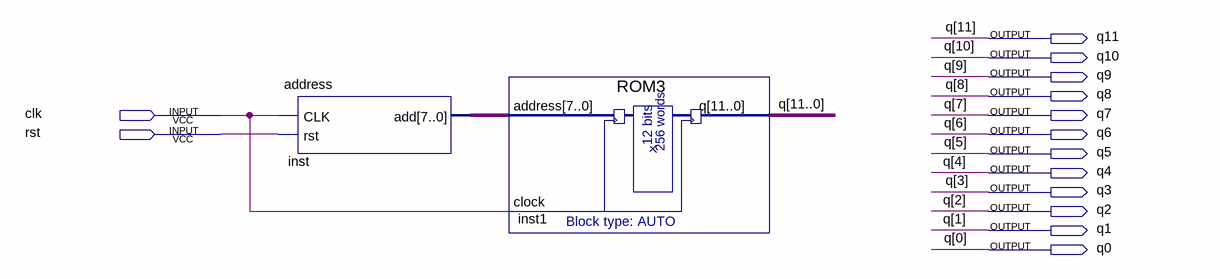
[diagram p0: schematic sheet]
// Quartus schematic generator3.bdf as structural Verilog: 2 symbols, 14 pins
module generator3 (
  input  clk,
  input  rst,
  output q11,
  output q10,
  output q9,
  output q8,
  output q7,
  output q6,
  output q5,
  output q4,
  output q3,
  output q2,
  output q1,
  output q0
);

  wire [7:0] inst_add;

  address inst (.CLK(clk), .rst(rst), .add(inst_add));
  ROM3 inst1 (.address(inst_add), .clock(clk), .q({q11, q10, q9, q8, q7, q6, q5, q4, q3, q2, q1, q0}));
endmodule
